# Altium schematic sheet LANModule.SchDoc
size A4
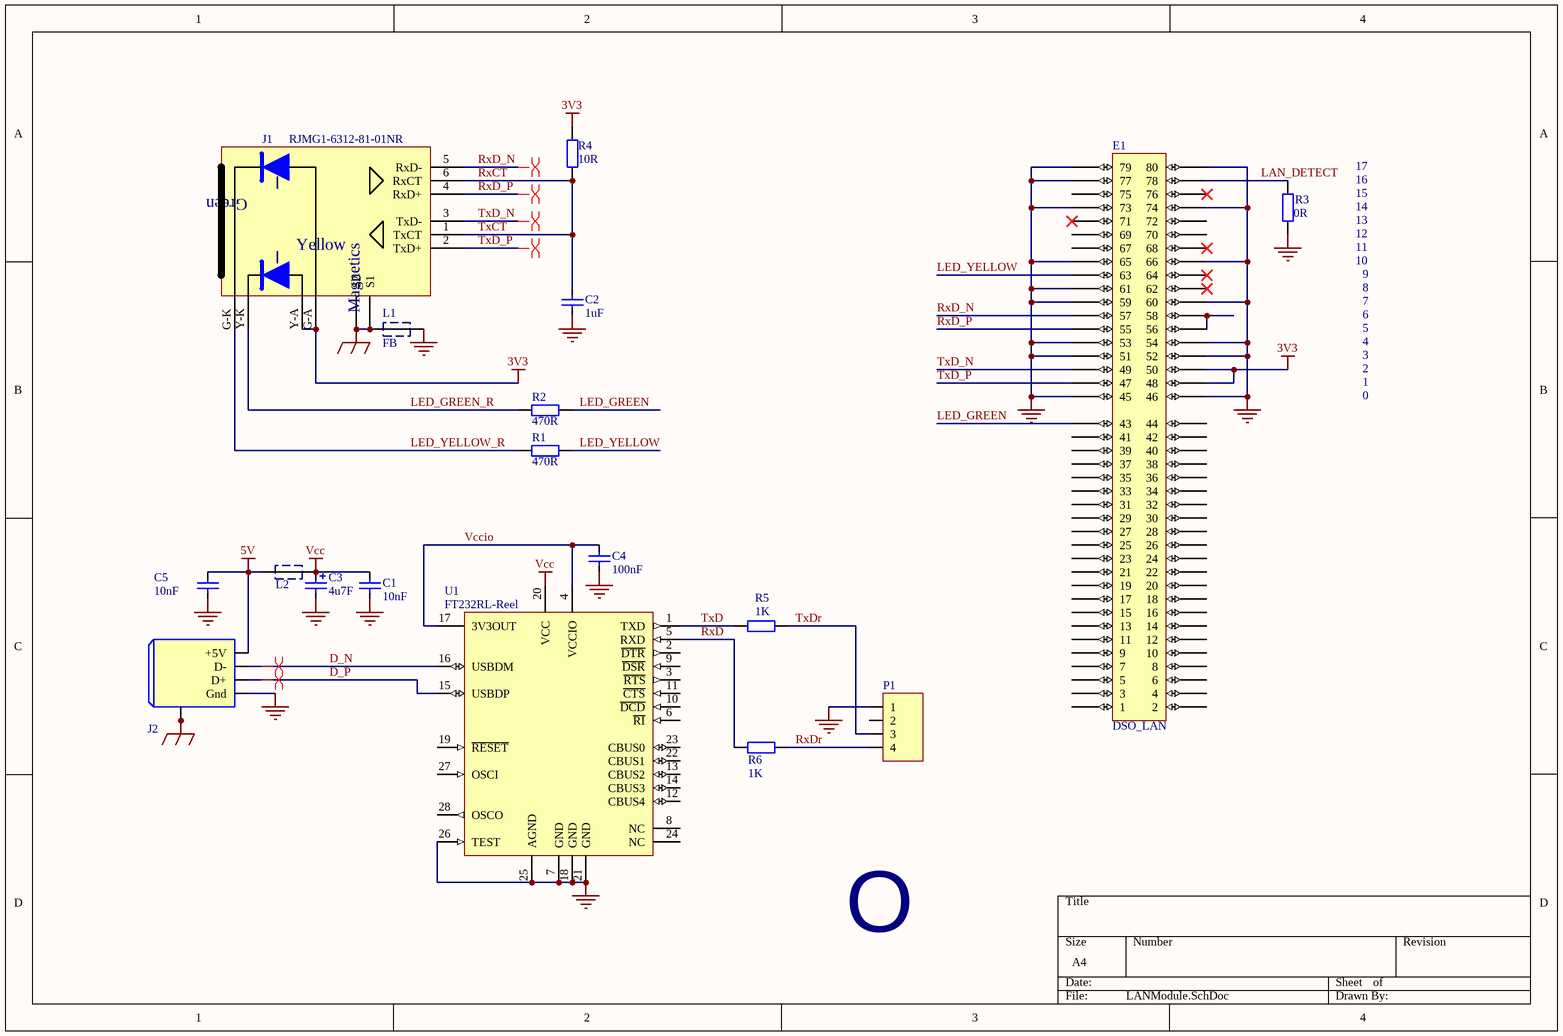
[diagram p0: LANModule.SchDoc]

## Parts
C1  10nF  [CCNP2012-0805]
C2  1uF  [CCNP2012-0805]
C3  4u7F  [CC2012-0805]
C4  100nF  [CCNP2012-0805]
C5  10nF  [CCNP2012-0805]
E1  DSO_LAN  [DSO_LAN]
J1  RJMG1-6312-81-01NR  [MagJack - Amphenol RJMG16]
J2  USB Type A Plug  [USB_BCon]  (value not drawn)
L1  FB  [CR2012-0805]
L2  Ferrite Bead  [FB2012-0805]  (value not drawn)
Logo  OSHW Logo  [OSHW]  (value not drawn)  (no BOM)
P1  Header 1x4H  [HDR1X4H]  (value not drawn)
R1  470R  [CR2012-0805]
R2  470R  [CR2012-0805]
R3  0R  [CR2012-0805]
R4  10R  [CR2012-0805]
R5  1K  [CR2012-0805]
R6  1K  [CR2012-0805]
U1  FT232RL-Reel  [SSOP-28_N]

## Nets
3V3: E1.48 E1.50 J1.G-A J1.Y-A R4.2
5V: C5.2 J2.5V(+5V) L2.1
EARTH: J1.S1 J1.S2 J2.Shield1(USBShd) J2.Shield2(USBShd) L1.1
GND: C1.1 C2.1 C3.2 C4.1 C5.1 E1.45 E1.46 E1.51 E1.52 E1.53 E1.54 E1.59 E1.60 E1.61 E1.65 E1.66 E1.73 E1.74 E1.77 E1.79 E1.80 J2.Gnd L1.2 P1.1 R3.2 U1.7(GND) U1.18(GND) U1.21(GND) U1.25(AGND) U1.26(TEST)
Vcc: C1.2 C3.1 L2.2 U1.20(VCC)
D_N: J2.D- U1.16(USBDM)
D_P: J2.D+ U1.15(USBDP)
LAN_DETECT: E1.78 R3.1
LED_GREEN: E1.43 R2.2
LED_GREEN_R: J1.Y-K R2.1
LED_YELLOW: E1.63 R1.2
LED_YELLOW_R: J1.G-K R1.1
RxCT: C2.2 J1.1(TxCT) J1.6(RxCT) R4.1  [also labelled TxCT]
RxD: R6.1 U1.5(RXD)
RxD_N: E1.57 J1.5(RxD-)
RxD_P: E1.55 J1.4(RxD+)
RxDr: P1.4 R6.2
TxD: R5.1 U1.1(TXD)
TxD_N: E1.49 J1.3(TxD-)
TxD_P: E1.47 J1.2(TxD+)
TxDr: P1.3 R5.2
Vccio: C4.2 U1.4(VCCIO) U1.17(3V3OUT)
NetE1_56: E1.56 E1.58

Not connected (* = marked no-connect by the designer): E1 1 2 3 4 5 6 7 8 9 10 11 12 13 14 15 16 17 18 19 20 21 22 23 24 25 26 27 28 29 30 31 32 33 34 35 36 37 38 39 40 41 42 44 62* 64* 67 68* 69 70 71* 72 75 76*; P1 2; U1 2(~{DTR}) 3(~{RTS}) 6(~{RI}) 8(NC) 9(~{DSR}) 10(~{DCD}) 11(~{CTS}) 12(CBUS4) 13(CBUS2) 14(CBUS3) 19(~{RESET}) 22(CBUS1) 23(CBUS0) 24(NC) 27(OSCI) 28(OSCO)

## Layout directives
differential pair: D_N, D_P, RxD_N, RxD_P, TxD_N, TxD_P

## Notes on the sheet
- 17
- 11
- 12
- 13
- 14
- 15
- 16
- 10
- 7
- 8
- 9
- 1
- 2
- 3
- 4
- 5
- 6
- 0
- (in symbol MagJack-RJMG1-6312-81-01NR) Green; l; Magnetics; Yellow
- (in symbol OSHW Logo) O

## Library data of the parts
C1 C2 C4 C5 = Cap: Capacitor; Manufacturer: Generic Components; Class: Passive; Published: 08/06/2000; Publisher: Altium Hobart Technology Centre; SubClass: Capacitor; Farnell PN: *; Digikey: *
  C1 C5: Value: 10nF
  C2: Value: 1uF
  C4: Value: 100nF
C3 = Cap Polar: Polarized Capacitor; Manufacturer: Generic Components; Class: Passive; Published: 08/06/2000; Publisher: Altium Hobart Technology Centre; SubClass: Capacitor; Farnell PN: *; Digikey: *; Value: 4u7F
J1 = MagJack-RJMG1-6312-81-01NR: RJ45 Jack with Magnetics (Amphenol); Farnell PN: 1357435; Digikey: *
J2 = USB_TYPE_A_PLUG: MOLEX 48037-1000; Digikey: *; Farnell PN: 2131387
L1 = Ferrite Bead 0805: Ferrite Bead (0805) 0.045OHM, 2A; Farnell PN: 1515661; Digikey: *
L2 = Ferrite Bead 0805: Ferrite Bead SMT 0805, TDK MPZ2012S102AT, 0.15OHM, 1.5A; Farnell PN: 1669733; Digikey: *
P1 = Header 1x4H: Header, 4-Pin, Right Angle; LatestRevisionDate: 17-Jul-2002; LatestRevisionNote: Re-released for DXP Platform.; Publisher: Altium Limited
R1-R4 = Res_CR0805: Resistor; Manufacturer: Generic Components; Class: Passive; Published: 08/06/2000; Publisher: Altium Hobart Technology Centre; SubClass: Resistor; Farnell PN: *; Digikey: *
  R1 R2: Value: 470R
  R3: Value: 0R
  R4: Value: 10R
R5 R6 = Res: Resistor; Manufacturer: Generic Components; Class: Passive; Published: 08/06/2000; Publisher: Altium Hobart Technology Centre; SubClass: Resistor; Farnell PN: *; Digikey: *; Value: 1K
U1 = FT232RL-Reel: USB UART Asynchronous Serial Data Transfer Chip, SSOP-28, Tape and Reel; Published: 19-Aug-2010; DatasheetVersion: ver 2.07, Jul-2010; PackageVersion: 2010; PackageReference: SSOP-28; Publisher: Altium Limited; PackageDescription: 28-Pin Small Outline Package 0.65 mm Pitch; ComponentLink1Description: Manufacturer Link; ComponentLink1URL: http://www.ftdichip.com/Products/ICs/FT232R.htm; ComponentLink2Description: Datasheet; ComponentLink2URL: http://www.ftdichip.com/Support/Documents/DataSheets/ICs/DS_FT232R.pdf